# EAGLE design tps76301 (EAGLE 7.1.0)
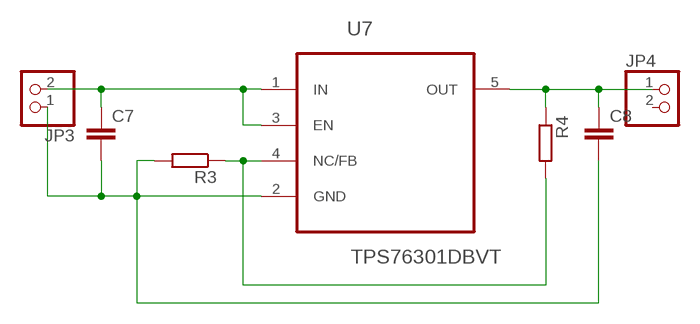
[diagram p0: schematic, sheet 1]

## Parts
C7  C-EUC0805  [C0805]
C8  C-EUC0805  [C0805]
JP3  PINHD-1X2  [1X02]
JP4  PINHD-1X2  [1X02]
R3  R-EU_R0805  [R0805]
R4  R-EU_R0805  [R0805]
U7  TPS76301DBVT  [SOT95P280X145-5N]

## Nets
GND: C7.2 C8.2 JP3.1 R3.2 U7.2(GND)
N$2: R3.1 R4.2 U7.4(NC/FB)
N$4: C8.1 JP4.1 R4.1 U7.5(OUT)
N$5: C7.1 JP3.2 U7.1(IN) U7.3(EN)
Unconnected: JP4.2

## Library data of the parts
C7 C8 = rcl:C-EU: CAPACITOR, European symbol
JP3 JP4 = pinhead:PINHD-1X2: PIN HEADER
R3 R4 = rcl:R-EU_: RESISTOR, European symbol
U7 = Texas Instruments_By_element14_Batch_1:TPS76301DBVT: Low power 150mA Low Dropout Linear Regulators; MPN: TPS76301DBVT; OC_FARNELL: 8461325; OC_NEWARK: 35K1346; PACKAGE: SOT-23-5; SUPPLIER: Texas Instruments

## Board
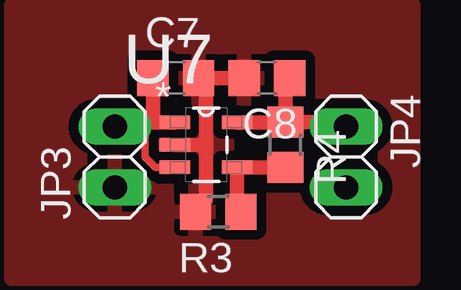
[diagram p1: board, top side]

No outline drawn. Coordinates in mm, seen from the top.
Copper layers (1*16): Top 0.035mm / dielectric 1.5mm / Bottom 0.035mm
Design rules "default": minimum track width 10mil, minimum drill 24mil, track to track 8mil, track to pad 8mil, pad to pad 8mil, via to via 8mil, smd to smd 8mil, copper to edge 40mil, drill to drill 8mil, minimum pad ring 10mil, minimum via ring 8mil, stop-mask expansion 4mil, vias tented up to drill 0mil, thermal gap 10mil

### Footprints (pad centres in the part's own frame; a part is rotated, then mirrored left to right if it is on the bottom)
C0805 = smd 1.3 x 1.5: 1 -0.95,0; 2 0.95,0
1X02 = drill 1.016 long: 1 -1.27,0; 2 1.27,0
R0805 = smd 1.3 x 1.5: 1 -0.95,0; 2 0.95,0
SOT95P280X145-5N = smd 1.27 x 0.559: 1 -1.295,0.94; 2 -1.295,0; 3 -1.295,-0.94; 4 1.295,-0.94; 5 1.295,0.94

### Placement (x,y rotation side)
C7  -58.42,44.7 0 top
C8  -54.61,44.7 180 top
JP3  -60.96,41.4 90 top
JP4  -51.31,41.4 270 top
R3  -56.64,39.12 180 top
R4  -53.85,41.91 270 top
U7  -57.15,41.91 0 top

### Tracks (layer width: path | path; a pad name or v marks a point on that pad's centre or on a via)
GND
  Top 0.61: C8.2 C7.2 -57.15,44.38 -57.15,41.91 | U7.2 -57.15,41.91 | -57.15,41.91 -57.15,39.62 -57.66,39.12
  pour Top (isolate 0.406): -65.28,47.75 -48.51,47.75 -48.51,36.32 -65.28,36.32
N$2
  Top 0.61: R4.2 U7.4 -55.85,39.46 R3.1
N$4
  Top 0.61: U7.5 R4.1 | R4.1 -53.85,44.52 C8.1 | R4.1 -51.5,42.86 JP4.1
N$5
  Top 0.305: U7.3 -59.26,40.97 -59.69,41.4 -59.69,42.6 -59.44,42.85
  Top 0.61: U7.1 -59.18,42.85 | -59.18,42.85 -59.44,42.85 -60.78,42.85 JP3.2 | C7.1 -59.37,43.04 -59.18,42.85